# Altium schematic sheet Pressure Sensors and ADC.SchDoc
size A4; SheetNumber: 2; SheetTotal: 9
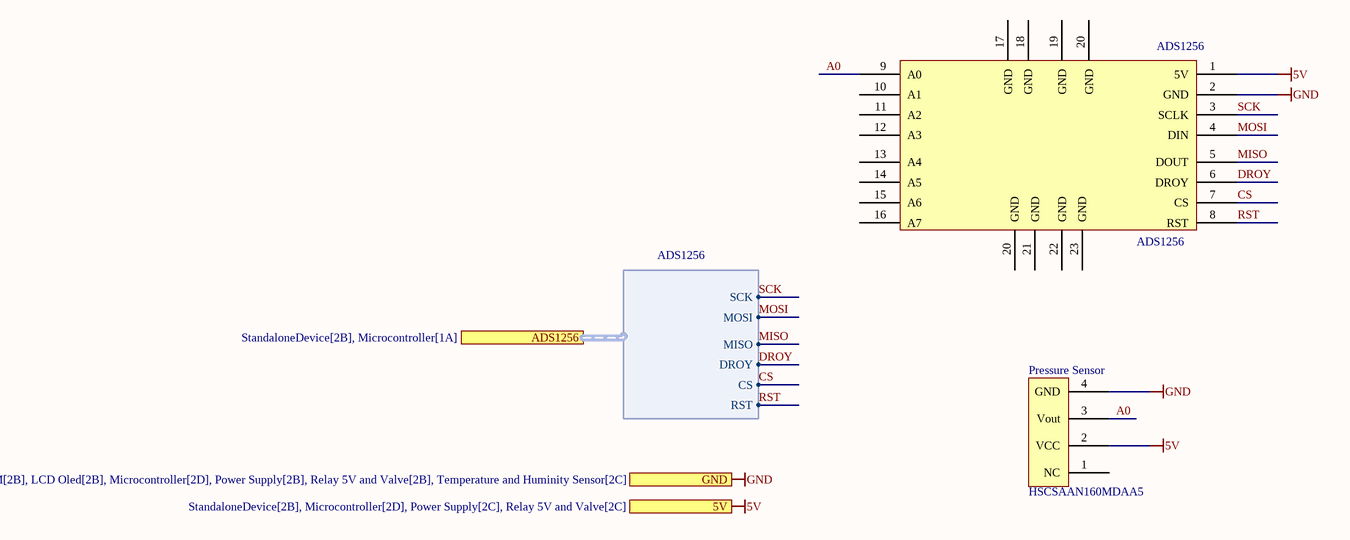
[diagram p0: Pressure Sensors and ADC.SchDoc]

## Parts
ADS1256  ADS1256  [ADS1256]
Pressure_Sensor  HSCSAAN160MDAA5  [HSCSAAN160MDAA5]

## Ports
5V (see StandaloneDevice[2B], Microcontroller[2D], Power Supply[2C], Relay 5V and Valve[2C]), ADS1256 (harness ADS1256, see StandaloneDevice[2B], Microcontroller[1A]), GND (see StandaloneDevice[2C], DS3231M[2B], LCD Oled[2B], Microcontroller[2D], Power Supply[2B], Relay 5V and Valve[2B], Temperature and Huminity Sensor[2C])

## Harnesses
ADS1256: SCK, MOSI, MISO, DROY, CS, RST

## Nets
5V: ADS1256.1(5V) Pressure_Sensor.2(VCC) ; port 5V
GND: ADS1256.2(GND) Pressure_Sensor.4(GND) ; port GND
A0: ADS1256.9(A0) Pressure_Sensor.3(Vout)
CS: ADS1256.7(CS) ; port ADS1256.CS
DROY: ADS1256.6(DROY) ; port ADS1256.DROY
MISO: ADS1256.5(DOUT) ; port ADS1256.MISO
MOSI: ADS1256.4(DIN) ; port ADS1256.MOSI
RST: ADS1256.8(RST) ; port ADS1256.RST
SCK: ADS1256.3(SCLK) ; port ADS1256.SCK

Not connected (* = marked no-connect by the designer): ADS1256 10(A1) 11(A2) 12(A3) 13(A4) 14(A5) 15(A6) 16(A7) 17(GND) 18(GND) 19(GND) 20(GND) 21(GND) 22(GND) 23(GND); Pressure_Sensor 1(NC)